# EAGLE design Fake Alarm (EAGLE 9.6.2)
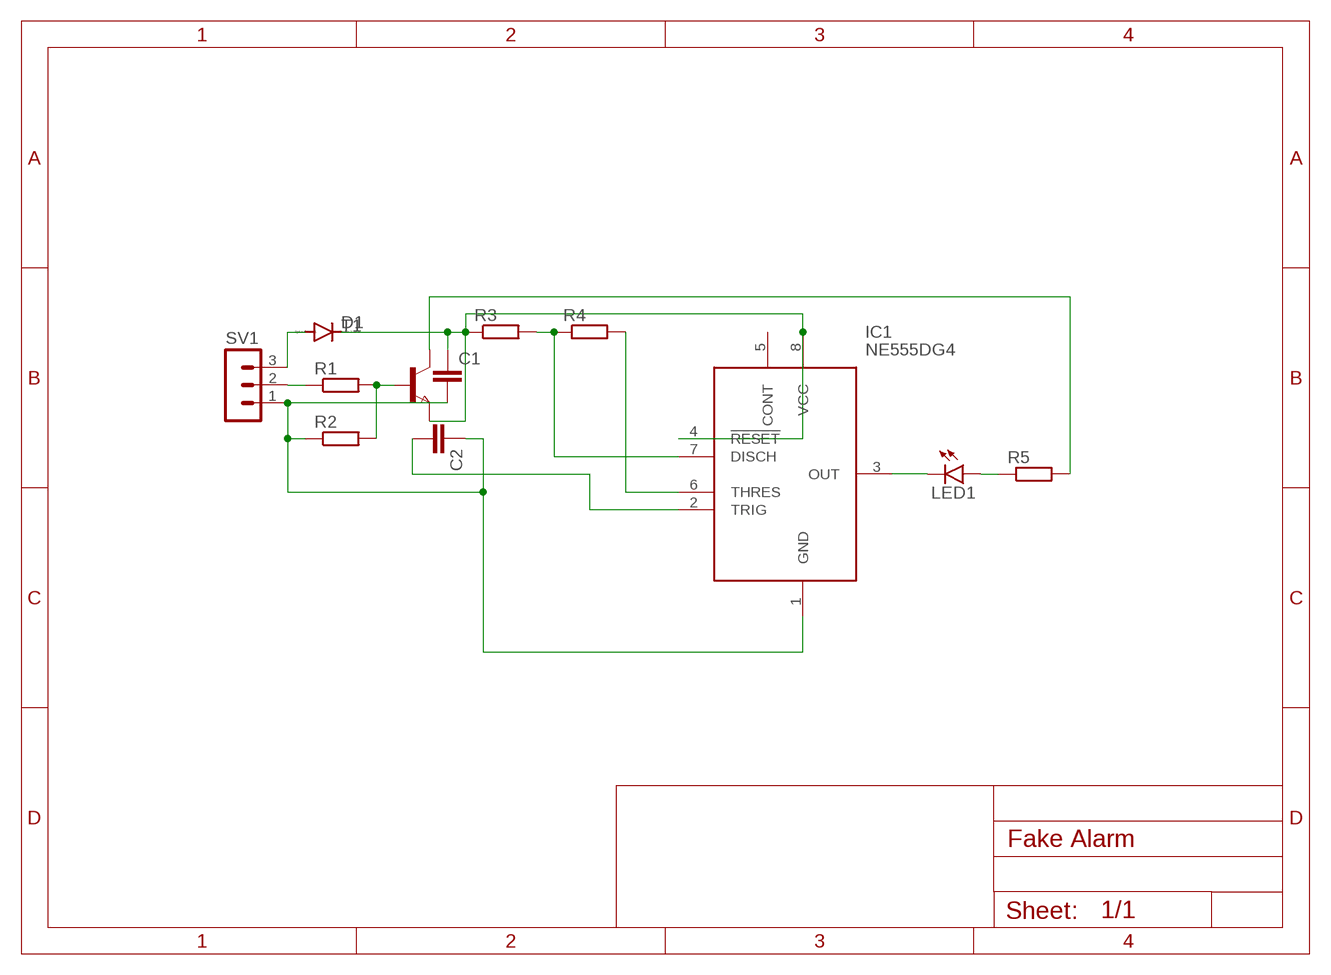
[diagram p0: schematic, sheet 1]

## Parts
C1  C-EUC0805  [C0805]
C2  C-EUC0805  [C0805]
D1  DIODE-DO-214AC  [DO-214AC]
IC1  NE555DG4  [SOIC127P600X175-8N]
LED1  LEDKA-3528ASYC  [KA-3528ASYC]
R1  R-EU_M0805  [M0805]
R2  R-EU_M0805  [M0805]
R3  R-EU_M0805  [M0805]
R4  R-EU_M0805  [M0805]
R5  R-EU_M0805  [M0805]
SV1  MA03-1  [MA03-1]
T1  NPNSOT23  [SOT-23]

## Nets
N$1: D1.A SV1.3
N$2: R1.1 SV1.2
N$3: C1.2 C2.1 IC1.1(GND) R2.1 SV1.1
N$4: C1.1 D1.C IC1.4(!RESET) IC1.8(VCC) R3.1 T1.2(E)
N$5: R1.2 R2.2 T1.3(B)
N$6: IC1.7(DISCH) R3.2 R4.1
N$7: C2.2 IC1.2(TRIG)
N$8: IC1.3(OUT) LED1.C
N$9: LED1.A R5.1
N$10: R5.2 T1.1(C)
N$11: IC1.6(THRES) R4.2
Unconnected: IC1.5(CONT)

## Library data of the parts
C1 C2 = rcl:C-EU: CAPACITOR, European symbol; SPICEPREFIX: C
D1 = diode:DIODE-: DIODE
IC1 = SamacSys_Parts:NE555DG4: Timers & Support Products SINGLE PRECISION TIMER Source: Datasheet <http://www.mouser.com/ds/2/405/ne555-557499.pdf>; ARROW_PART_NUMBER: NE555DG4; ARROW_PRICE-STOCK: https://www.arrow.com/en/products/ne555dg4/texas-instruments; DESCRIPTION: Timers & Support Products SINGLE PRECISION TIMER; HEIGHT: 1.75mm; MANUFACTURER_NAME: Texas Instruments; MANUFACTURER_PART_NUMBER: NE555DG4; MOUSER_PART_NUMBER: 595-NE555DG4; MOUSER_PRICE-STOCK: https://www.mouser.co.uk/ProductDetail/Texas-Instruments/NE555DG4/?qs=rLYyFdxB%2FmoTBxH9w0Er2A%3D%3D
LED1 = led:LED: LED OSRAM: - CHIPLED LG R971, LG N971, LY N971, LG Q971, LY Q971, LO R971, LY R971 LH N974, LH R974 LS Q976, LO Q976, LY Q976 LO Q996 - Hyper CHIPLED LW Q18S LB Q993, LB Q99A, LB R99A - SideLED LS A670, LO A670, LY A670, LG A670, LP A670 LB A673, LV A673, LT A673, LW A673 LH A674 LY A675 LS A676, LA A676, LO A676, LY A676, LW A676 LS A679, LY A679, LG A679 - Hyper Micro SIDELED® LS Y876, LA Y876, LO Y876, LY Y876 LT Y87S - SmartLED LW L88C, LW L88S LB L89C, LB L89S, LG L890 LS L89K, LO L89K, LY L89K LS L896, LA L896, LO L896, LY L896 - TOPLED LS T670, LO T670, LY T670, LG T670, LP T670 LSG T670, LSP T670, LSY T670, LOP T670, LYG T670 LG T671, LOG T671, LSG T671 LB T673, LV T673, LT T673, LW T673 LH T674 LS T676, LA T676, LO T676, LY T676, LB T676, LH T676, LSB T676, LW T676 LB T67C, LV T67C, LT T67C, LS T67K, LO T67K, LY T67K, LW E67C LS E67B, LA E67B, LO E67B, LY E67B, LB E67C, LV E67C, LT E67C LW T67C LS T679, LY T679, LG T679 LS T770, LO T770, LY T770, LG T770, LP T770 LB T773, LV T773, LT T773, LW T773 LH T774 LS E675, LA E675, LY E675, LS T675 LS T776, LA T776, LO T776, LY T776, LB T776 LHGB T686 LT T68C, LB T68C - Hyper Mini TOPLED® LB M676 - Mini TOPLED Santana® LG M470 LS M47K, LO M47K, LY M47K Source: http://www.osram.convergy.de LUXEON: - LUMILED® LXK2-PW12-R00, LXK2-PW12-S00, LXK2-PW14-U00, LXK2-PW14-V00 LXK2-PM12-R00, LXK2-PM12-S00, LXK2-PM14-U00 LXK2-PE12-Q00, LXK2-PE12-R00, LXK2-PE12-S00, LXK2-PE14-T00, LXK2-PE14-U00 LXK2-PB12-K00, LXK2-PB12-L00, LXK2-PB12-M00, LXK2-PB14-N00, LXK2-PB14-P00, LXK2-PB14-Q00 LXK2-PR12-L00, LXK2-PR12-M00, LXK2-PR14-Q00, LXK2-PR14-R00 LXK2-PD12-Q00, LXK2-PD12-R00, LXK2-PD12-S00 LXK2-PH12-R00, LXK2-PH12-S00 LXK2-PL12-P00, LXK2-PL12-Q00, LXK2-PL12-R00 Source: www.luxeon.com KINGBRIGHT: KA-3528ASYC Source: www.kingbright.com
R1-R5 = resistor:R-EU_: RESISTOR, European symbol
SV1 = con-lstb:MA03-1: PIN HEADER; OC_FARNELL: unknown; OC_NEWARK: unknown
T1 = zetex:NPNSOT23: NPN TRANSISTOR; MPN: DSS20201L-7; OC_FARNELL: 1710688; OC_NEWARK: 25R4555

## Board
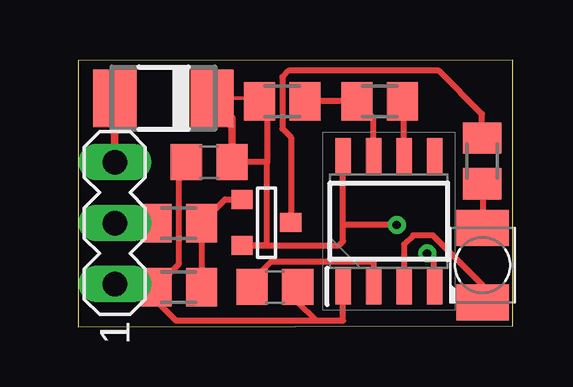
[diagram p1: board, top side]
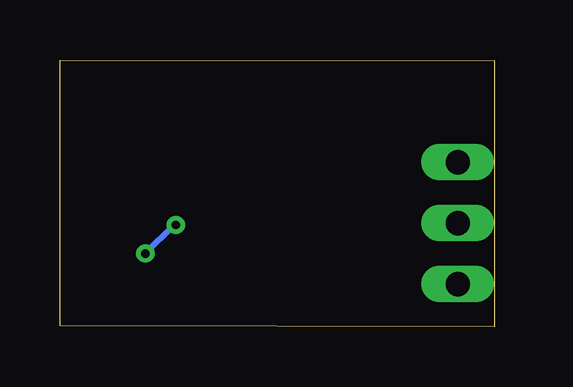
[diagram p2: board, bottom side, seen from below]

Size 18.12 x 11.13 mm. Coordinates in mm from the lower left corner, seen from the top.
Outline: 0,0 18.12,0.03 18.12,11.12 0,11.1 0,0
Copper layers (1*16): Top 0.035mm / dielectric 1.5mm / Bottom 0.035mm
Design rules "default": minimum track width 6mil, minimum drill 0.35mm, track to track 6mil, track to pad 6mil, pad to pad 6mil, via to via 6mil, smd to smd 6mil, copper to edge 40mil, drill to drill 6mil, minimum pad ring 10mil, minimum via ring 8mil, stop-mask expansion 4mil, vias tented up to drill 0mil, thermal gap 10mil

### Footprints (pad centres in the part's own frame; a part is rotated, then mirrored left to right if it is on the bottom)
C0805 = smd 1.3 x 1.5: 1 -0.95,0; 2 0.95,0
DO-214AC = smd 1.8 x 2.4: A 2.025,0; C -2.025,0
SOIC127P600X175-8N = smd 1.525 x 0.65: 1 -2.712,1.905; 2 -2.712,0.635; 3 -2.712,-0.635; 4 -2.712,-1.905; 5 2.712,-1.905; 6 2.712,-0.635; 7 2.712,0.635; 8 2.712,1.905
KA-3528ASYC = smd 1.5 x 2.2: A -1.55,0; C 1.55,0
M0805 = smd 1.3 x 1.6: 1 -0.95,0; 2 0.95,0
MA03-1 = drill 1.016 long: 1 -2.54,0; 2 0,0; 3 2.54,0
SOT-23 = smd 0.787 x 0.889: 1 0.025,-1.016; 2 -0.94,1.016; 3 0.991,1.016

### Placement (x,y rotation side)
C1  5.46,6.86 180 top
C2  8.2,1.65 180 top
D1  3.56,9.53 180 top
IC1  12.95,4.39 90 top
LED1  16.87,2.57 270 top
R1  4.19,4.32 0 top
R2  4.19,1.65 0 top
R3  8.51,9.4 0 top
R4  12.57,9.4 0 top
R5  16.84,6.91 90 top
SV1  1.52,4.32 90 top
T1  7.85,4.32 90 top

### Tracks (layer width: path | path; a pad name or v marks a point on that pad's centre or on a via)
N$1
  Top 0.254: SV1.3
  Top 0.305: SV1.3 1.52,9.52 D1.A
N$2
  Top 0.254: R1.1 SV1.2
N$3
  Top 0.254: R2.1 1.65,1.65 SV1.1 | R2.1 4.18,2.59 4.18,6.53 C1.2 | R2.1 3.24,1.08 4.06,0.25 9.91,0.25 | 9.91,0.25 11.05,0.25 IC1.1 | C2.1 9.15,1.01 9.91,0.25
N$4  (via drill 0.35)
  Top 0.152: D1.C 7.43,9.53 R3.1
  Top 0.254: 7.87,6.86 7.87,3.38 T1.2 10.87,3.38 11.05,3.56 11.05,4.24 | 7.87,6.86 C1.1 | R3.1 7.87,9.08 7.87,6.86 | 11.05,4.24 IC1.8 10.97,7.19 | v14.55,3.05 14.81,2.79 14.81,1.73 IC1.4 | v13.28,4.24 11.05,4.24
  Top 0.305: C1.1 6.41,8.7 D1.C
  Bottom 0.254: v14.55,3.05 13.36,4.24 v13.28,4.24
N$5
  Top 0.254: R2.2 R1.2 6.13,5.31 T1.3
N$6
  Top 0.254: IC1.7 12.32,8.7 R4.1 R3.2
N$7
  Top 0.254: C2.2 7.25,1.92 8.05,2.72 12.32,2.72 IC1.2
N$8
  Top 0.254: LED1.C 16.87,1.73 14.78,3.81 13.97,3.81 13.59,3.43 IC1.3
N$9
  Top 0.254: R5.1 16.87,5.93 LED1.A
N$10
  Top 0.254: R5.2 16.84,8.88 15.05,10.67 8.76,10.67 8.51,10.41 8.51,8.26 8.87,7.9 T1.1
N$11
  Top 0.254: IC1.6 13.59,9.33 R4.2